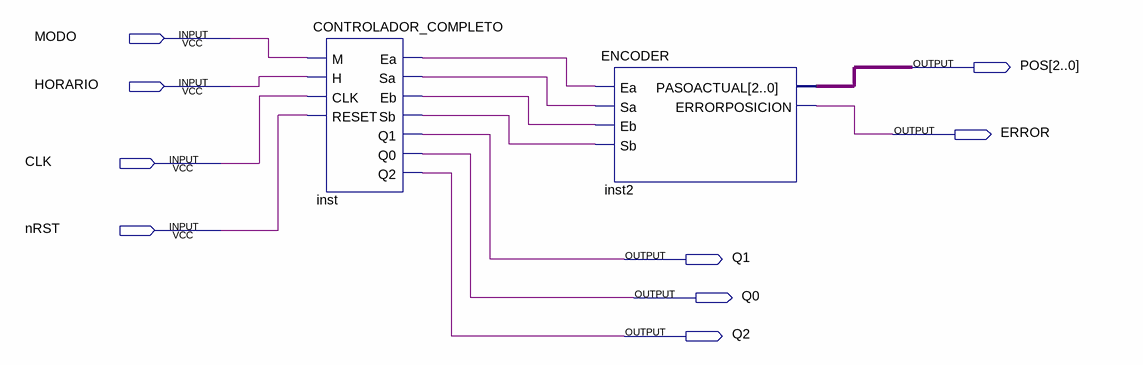
[diagram p0: schematic sheet]
// Quartus schematic PRUEBA.bdf as structural Verilog: 2 symbols, 9 pins
module PRUEBA (
  input  MODO,
  input  HORARIO,
  input  CLK,
  input  nRST,
  output [2:0] POS,
  output ERROR,
  output Q1,
  output Q0,
  output Q2
);

  wire inst_ea, inst_eb, inst_sa, inst_sb;

  CONTROLADOR_COMPLETO inst (
    .M(MODO), .H(HORARIO), .CLK(CLK), .RESET(nRST), .Ea(inst_ea), .Sa(inst_sa), .Eb(inst_eb), .Sb(inst_sb),
    .Q1(Q1), .Q0(Q0), .Q2(Q2));
  ENCODER inst2 (.Ea(inst_ea), .Sa(inst_sa), .Eb(inst_eb), .Sb(inst_sb), .PASOACTUAL(POS), .ERRORPOSICION(ERROR));
endmodule
